# Altium schematic sheet 2_MCU.SchDoc
size A4; SheetNumber: 3; SheetTotal: 6; SPICEModelCacheTOFGAPIR: <root> / <DocumentId>TOFGAPIR</DocumentId> / </root>
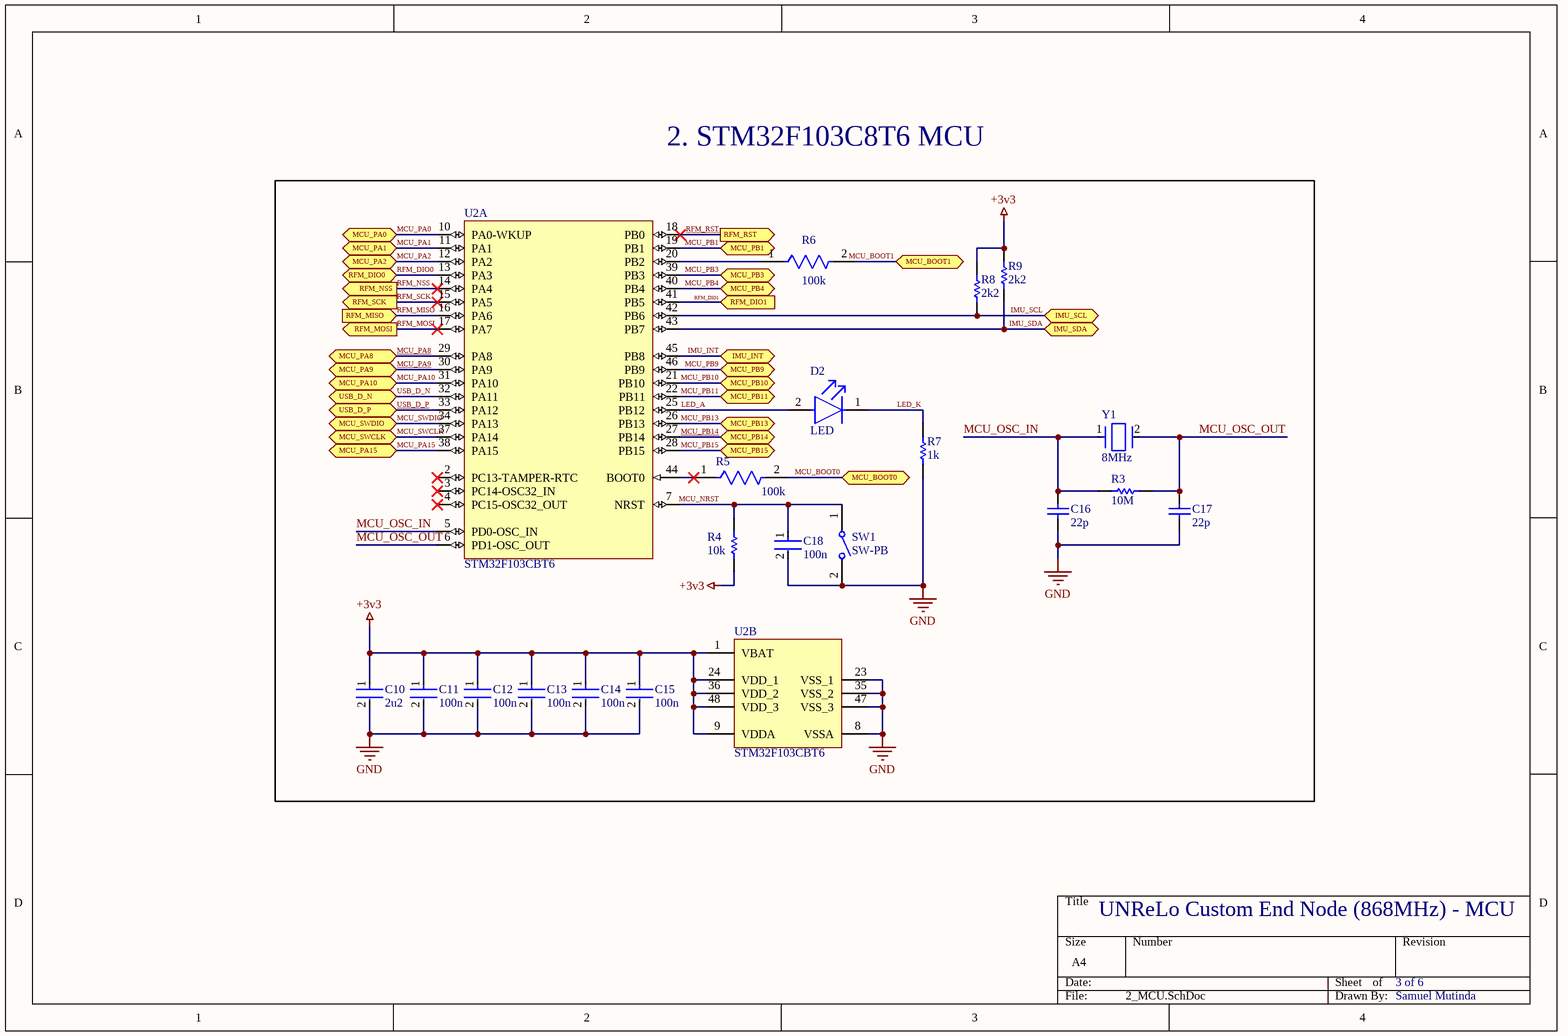
[diagram p0: 2_MCU.SchDoc]

## Parts
C10  2u2  [FP-C0603C225K4PACTU-MFG]
C11  100n  [FP-C0402-BB-MFG]
C12  100n  [FP-C0402-BB-MFG]
C13  100n  [FP-C0402-BB-MFG]
C14  100n  [FP-C0402-BB-MFG]
C15  100n  [FP-C0402-BB-MFG]
C16  22p  [CAPC1006X50X20ML10T10]
C17  22p  [CAPC1006X50X20ML10T10]
C18  100n  [FP-C0402-BB-MFG]
D2  LED  [FP-LTST-C191TBKT-MFG]
R3  10M  [RESC1005X40X25LL05T05]
R4  10k  [RESC1005X40X25LL05T05]
R5  100k  [FP-ERJ2RK-IPC_C]
R6  100k  [FP-ERJ2RK-IPC_C]
R7  1k  [RESC1005X40X25NL05T05]
R8  2k2  [RESC1005X40X25NL05T10]
R9  2k2  [RESC1005X40X25NL05T10]
SW1  SW-PB  [TECO-FSMSM-2_V]
U2  STM32F103CBT6  [STM-LQFP48_L]  (parts A,B of 2)
Y1  8MHz  [FP-ABLS-MFG]

## Ports
IMU_INT (bidir), IMU_SCL (bidir), IMU_SDA (bidir), MCU_BOOT0 (bidir), MCU_BOOT1 (bidir), MCU_PA0 (bidir), MCU_PA1 (bidir), MCU_PA2 (bidir), MCU_PA8 (bidir), MCU_PA9 (bidir), MCU_PA10 (bidir), MCU_PA15 (bidir), MCU_PB1 (bidir), MCU_PB3 (bidir), MCU_PB4 (bidir), MCU_PB9 (bidir), MCU_PB10 (bidir), MCU_PB11 (bidir), MCU_PB13 (bidir), MCU_PB14 (bidir), MCU_PB15 (bidir), MCU_SWCLK (bidir), MCU_SWDIO (bidir), RFM_DIO0 (bidir), RFM_DIO1 (in), RFM_MISO (in), RFM_MOSI (out), RFM_NSS (out), RFM_RST (out), RFM_SCK (out), USB_D_N (bidir), USB_D_P (bidir)

## Nets
+3v3: C10.1 C11.1 C12.1 C13.1 C14.1 C15.1 R4.1 R8.2 R9.2 U2.1(VBAT) U2.9(VDDA) U2.24(VDD_1) U2.36(VDD_2) U2.48(VDD_3)
GND: C10.2 C11.2 C12.2 C13.2 C14.2 C15.2 C16.1 C17.1 C18.2 R7.1 SW1.2 U2.8(VSSA) U2.23(VSS_1) U2.35(VSS_2) U2.47(VSS_3)
IMU_INT: U2.45(PB8) ; port IMU_INT
IMU_SCL: R8.1 U2.42(PB6) ; port IMU_SCL
IMU_SDA: R9.1 U2.43(PB7) ; port IMU_SDA
LED_A: D2.2(A) U2.25(PB12)
LED_K: D2.1(C) R7.2
MCU_BOOT0: R5.2 ; port MCU_BOOT0
MCU_BOOT1: R6.2 ; port MCU_BOOT1
MCU_NRST: C18.1 R4.2 SW1.1 U2.7(NRST)
MCU_OSC_IN: C16.2 R3.1 U2.5(PD0-OSC_IN) Y1.1
MCU_OSC_OUT: C17.2 R3.2 U2.6(PD1-OSC_OUT) Y1.2
MCU_PA0: U2.10(PA0-WKUP) ; port MCU_PA0
MCU_PA1: U2.11(PA1) ; port MCU_PA1
MCU_PA2: U2.12(PA2) ; port MCU_PA2
MCU_PA8: U2.29(PA8) ; port MCU_PA8
MCU_PA9: U2.30(PA9) ; port MCU_PA9
MCU_PA10: U2.31(PA10) ; port MCU_PA10
MCU_PA15: U2.38(PA15) ; port MCU_PA15
MCU_PB1: U2.19(PB1) ; port MCU_PB1
MCU_PB3: U2.39(PB3) ; port MCU_PB3
MCU_PB4: U2.40(PB4) ; port MCU_PB4
MCU_PB9: U2.46(PB9) ; port MCU_PB9
MCU_PB10: U2.21(PB10) ; port MCU_PB10
MCU_PB11: U2.22(PB11) ; port MCU_PB11
MCU_PB13: U2.26(PB13) ; port MCU_PB13
MCU_PB14: U2.27(PB14) ; port MCU_PB14
MCU_PB15: U2.28(PB15) ; port MCU_PB15
MCU_SWCLK: U2.37(PA14) ; port MCU_SWCLK
MCU_SWDIO: U2.34(PA13) ; port MCU_SWDIO
RFM_DIO0: U2.13(PA3) ; port RFM_DIO0
RFM_DIO1: U2.41(PB5) ; port RFM_DIO1
RFM_MISO: U2.16(PA6) ; port RFM_MISO
RFM_MOSI: U2.17(PA7) ; port RFM_MOSI
RFM_NSS: U2.14(PA4) ; port RFM_NSS
RFM_RST: U2.18(PB0) ; port RFM_RST
RFM_SCK: U2.15(PA5) ; port RFM_SCK
USB_D_N: U2.32(PA11) ; port USB_D_N
USB_D_P: U2.33(PA12) ; port USB_D_P
NetR5_1: R5.1 U2.44(BOOT0)
NetR6_1: R6.1 U2.20(PB2)

Not connected (* = marked no-connect by the designer): U2 2(PC13-TAMPER-RTC)* 3(PC14-OSC32_IN)* 4(PC15-OSC32_OUT)*

## Notes on the sheet
- 2. STM32F103C8T6 MCU
- UNReLo Custom End Node (868MHz) - MCU
- 3 of 6
- Samuel Mutinda

## Library data of the parts
C10 = CMP-2006-02259-2: CAP CER 2.2UF 16V X5R 0603; Manufacturer 1: Taiyo Yuden; Dielectric Material: Ceramic; Tolerance: 10%; Dissipation Factor: 5%; Name: EMK107BB7225MA-T; Series: C; Voltage Rating (DC): 16V; REACH SVHC: No SVHC; RoHS Compliant: Yes; Number of Pins: 2; Max Operating Temperature: 85°C; Voltage Rating: 16V; Min Operating Temperature: -55°C; Termination: SMD/SMT; Dielectric: X5R; Packaging: Tape and Reel; Contact Plating: Tin; Case Code (Metric): 1608; Height: 0.8mm; Capacitance: 2.2uF; Case/Package: 0603; Width: 0.8mm; Construction: Flat; Depth: 0.8mm; Thickness: 0.034inch; Radiation Hardening: No; Length: 1.6mm; Mount: Surface Mount; Case Code (Imperial): 0603; Voltage: 16V; Package Quantity: 1; Lead Free: Lead Free; Manufacturer Part Number 1: EMK107BB7225MA-T; Supplier 1: Digi-Key; Supplier Part Number 1: 587-4864-1-ND; Supplier Unit Price 1: $0.27
C11-C15 C18 = CMP-1034-02068-3: CAP CER 0.1UF 16V 10% X7R 0402; Manufacturer 1: TDK Corporation; Value: 0.10 μF; Temperature Coefficient: 15%; Tolerance: 0.1; Material: Ceramic; Name: CGA2B1X7R1C104K050BC; ComponentLink2URL: https://content.kemet.com/datasheets/KEM_C1002_X7R_SMD.pdf; Automotive: No; Device Class L2: Capacitors; Temperature: -55°C to +125°C; RoHS: TRUE; Voltage Rating: 16 V; ComponentLink2Description: Datasheet; Device Class L3: Ceramic Capacitors; Temperature Range Low: -55°C; Ipc Land Pattern Name: CAPC10050X50; Device Class L1: Passive Components; Temperature Range High: +125°C; Package: C0402-BB; Capacitance: 0.10 μF; Category: Cap; Mouser Description: CAP CER 0.1UF 16V X7R 0402; Height: 0.55mm; Digikey Description: CAP CER 0.1UF 16V 5% X7R 0402; Octopart: https://octopart.com/c0402c104j4ractu-kemet-12573893; Temperature Characteristic: X7R; Lead Free: Yes; Manufacturer Part Number 1: CGA2B1X7R1C104K050BC; Supplier 1: Digi-Key; Supplier Part Number 1: 445-5613-1-ND; Supplier Unit Price 1: $0.1
C16 C17 = CMP-2008-04844-1: Manufacturer 1: Murata Electronics; Name: GCM1555G1H220JA16D; Manufacturer Part Number 1: GCM1555G1H220JA16D; Supplier 1: Digi-Key; Supplier Part Number 1: 490-GCM1555G1H220JA16DCT-ND; Supplier Unit Price 1: $0.1
D2 = CMP-22017-000008-1: LED WHITE; Lens Color: Colorless; Dominant Wavelength: 475nm; Forward Current: 20mA; Wavelength: 468nm; Viewing Angle: 130°; Lens Transparency: Clear; Power Dissipation: 76mW; Illumination Color: Blue; Luminous Intensity: 180mcd; Reverse Voltage: 5V; Number of Elements: 1; Lens Style: Diffused; Forward Voltage: 3.8V; Max Power Dissipation: 75mW; Case Code (Metric): 1608; Packaging: Tape and Reel; Case/Package: 0603; Depth: 1.6mm; Mount: Surface Mount; Lead Free: Lead Free; Min Operating Temperature: -20°C; Height: 0.55mm; Test Current: 20mA; Case Code (Imperial): 0603; Max Operating Temperature: 80°C; Number of Pins: 2; Length: 0.8mm; Radiation Hardening: No; Package Quantity: 1; Number of LEDs: 1; Width: 0.8mm; Color: Blue
R3 = CMP-1011-00962-2: Manufacturer 1: Vishay Dale; Name: CRCW040210M0FKED; Manufacturer Part Number 1: CRCW040210M0FKED; Supplier 1: Digi-Key; Supplier Part Number 1: 541-10.0MLCT-ND; Supplier Unit Price 1: $0.1
R4 = CMP-2000-07588-1: Chip Resistor, 10 KOhm, +/- 1%, 0.1 W, -55 to 155 degC, 0402 (1005 Metric), RoHS, Tape and Reel; Manufacturer 1: Vishay Beyschlag/Draloric/BC Components; Power Rating: 100mW; Voltage Rating: 50V; Resistance: 10KOhm; Case\/Package: 0402; Temperature Coefficient: 100ppm\/degreesC; Name: MCS04020C1002FE000; RoHSCompliant: True; Lead Free: LeadFree; Package Quantity: 1; Contact Plating: Tin; Length: 1mm; Radiation Hardening: No; REACH SVHC: NoSVHC; Max Operating Temperature: 155degC; Depth: 0.5mm; Case Code (Imperial): 0402; Military Standard: Not; Package Description: 2-Pin Surface Mount Device, Body 1 x 0.5 mm; Termination: SMD/SMT; Case Code (Metric): 1005; Height: 0.35mm; Packaging: TapeandReel; Voltage Rating (DC): 50V; Package Reference: 402; Number of Pins: 2; Tolerance: 1%; Mounting Technology: SurfaceMount; Width: 0.02inch; Mount: SurfaceMount; Datasheet URL: https://industrial.panasonic.com/cdbs/www-data/pdf/RDA0000/AOA0000C304.pdf; Composition: ThickFilm; Datasheet Version: 02/2017; Max Power Dissipation: 100mW; Number of Terminations: 2; Min Operating Temperature: -55degC; Manufacturer Part Number 1: MCS04020C1002FE000; Supplier 1: Digi-Key; Supplier Part Number 1: MCS0402-10.0K-CFCT-ND; Supplier Unit Price 1: $0.15
R5 R6 = CMP-2002-00608-4: RES SMD 100K OHM 1% 1/10W 0402; Manufacturer 1: Panasonic Electronic Components; Resistance: 100kR; Voltage Rating (DC): 50V; Power Rating: 100mW; Temperature Coefficient: 100ppm/°C; Name: ERJ-PA2J104X; Case/Package: 0402; Length: 1mm; Package Quantity: 1; Radiation Hardening: No; Case Code (Metric): 1005; Contact Plating: Tin; Mount: Surface Mount; Depth: 0.5mm; Max Operating Temperature: 155°C; Lead Free: Lead Free; Width: 0.5mm; Composition: Thick Film; Case Code (Imperial): 0402; Tolerance: 1%; Termination: SMD/SMT; Number of Pins: 2; Height: 0.35mm; Voltage Rating: 50V; Military Standard: Not; REACH SVHC: No SVHC; Packaging: Tape and Reel; Min Operating Temperature: -55°C; Max Power Dissipation: 100mW; Features: Automotive AEC-Q200; Number of Terminations: 2; Manufacturer Part Number 1: ERJ-PA2J104X; Supplier 1: Digi-Key; Supplier Part Number 1: P17205CT-ND; Supplier Unit Price 1: $0.16
R7 = CMP-1011-00510-4: Chip Resistor, 1 KOhm, +/- 1%, 100 mW, -55 to 155 degC, 0402 (1005 Metric), RoHS, Tape and Reel; Manufacturer: Basic Passives; Manufacturer 1: Panasonic Electronic Components; Voltage Rating: 50 V; Case\/Package: 0402; Resistance: 1 KOhm; Power Rating: 100 mW; Name: ERJ-2RKF1001X; DatasheetVersion: 04/2015; Radiation Hardening: No; Pins: 2; Height: 0.35 mm; RoHSCompliant: true; Case Code (Imperial): 0402; ComponentLink2Description: Datasheet; ComponentLink1Description: Manufacturer URL; PackageReference: 0402; Mount: Surface Mount; Package Quantity: 10000; Tolerance: 1%; ComponentLink1URL: http://www.panasonic.com/; PackageDescription: 2-Pin Surface Mount Device, Body 1 x 0.5 mm; Mounting Technology: Surface Mount; Case Code (Metric): 1005; ComponentLink2URL: http://industrial.panasonic.com/cdbs/www-data/pdf/RDA0000/AOA0000C86.pdf; REACH SVHC: Yes; Packaging: Tape and Reel; Max Operating Temperature: 155 degC; Min Operating Temperature: -55 degC; Width: 0.5 mm; Length: 1 mm; Manufacturer Part Number 1: ERJ-2RKF1001X; Supplier 1: Digi-Key; Supplier Part Number 1: P1.00KLCT-ND; Supplier Unit Price 1: $0.10
R8 R9 = CMP-2002-07567-1: Manufacturer 1: YAGEO; Name: RC0402FR-072K2L; Manufacturer Part Number 1: RC0402FR-072K2L; Supplier 1: Digi-Key; Supplier Part Number 1: 311-2.20KLRCT-ND; Supplier Unit Price 1: $0.1
SW1 = CMP-2000-07511-1: FSMSM Push Button Switch, 50 mA, -35 to 85 degC, 2-Pin SMD, RoHS, Bulk; Manufacturer: TE Connectivity; Manufacturer 1: TE Connectivity ALCOSWITCH Switches; Actuator Length: 1.07mm; Electrical Life: 20000Cycles; Actuator Material: Polyamide; Current Rating: 50mA; Illumination Type: Illuminated; Voltage Rating (DC): 24V; Contact Resistance: 100mOhm; Case\/Package: SMD/SMT; Operating Force: 180gf; Switch Travel: 0.25mm; Max Voltage Rating (DC): 12V; Throw Configuration: SPST; Packaging: LoosePiece; Max Operating Temperature: 85degC; ELV: Compliant; Package Description: 2-Pin Surface Mount Device, Body 6 x 3.5 mm, Pitch 9.19 mm; RoHSCompliant: true; Manufacturer URL: http://www.te.com/; Contact Plating: Silver; Contact Material: Brass; Mounting Technology: SurfaceMount; Contact Current Rating: 50mA; Datasheet Version: Rev. C2, 08/2014; Datasheet URL: http://www.te.com/commerce/DocumentDelivery/DDEController?Action=showdoc&DocId=Customer+Drawing%7F1437566-3%7FC2%7Fpdf%7FEnglish%7FENG_CD_1437566-3_C2_1437566_3_1_c.dwg.pdf%7F1437566-3; Mechanical Life: 20000Cycles; Package Reference: FSMSM; REACH SVHC: Unknown; Orientation: Straight; Min Operating Temperature: -35degC; Lead Free: LeadFree; Termination: GullWing; Package Quantity: 1000; Mount: SurfaceMount; Name: FSMSM; Manufacturer Part Number 1: FSMSM; Supplier 1: Digi-Key; Supplier Part Number 1: 450-1140-ND; Supplier Unit Price 1: $0.32
U2 = CMP-0237-00250-3: ARM Cortex-M3 32-bit MCU, 128 KB Flash, 20 KB Internal RAM, 37 I/Os, 48-pin LQFP, -40 to 85 degC, Tray; Manufacturer 1: STMicroelectronics; Supply Voltage(Vcc) min (V): 2; Operating Frequency(F) (Processor speed) (MHz): 72; A/D Converter: 2x12-bit (10 Channel); FLASH Size (Prog) (kB): 128; Internal RAM Size (kB): 20; I/Os (High Current): 37; ComponentLink2Description: Datasheet; PackageReference: LQFP48; ComponentLink1Description: Manufacturer URL; DatasheetVersion: Rev. 16; PackageVersion: Rev. 6, 06/2013; Packing: Tray; ComponentLink1URL: http://www.st.com/web/en/home.html; Mounting Technology: Surface Mount; ComponentLink3URL: http://www.st.com/st-web-ui/static/active/en/resource/technical/document/datasheet/DM00058181.pdf; PackageDescription: 48-Pin Low Profile Quad Flat Package, 7 x 7 mm Body, 0.5 mm Pitch; Core: ARM Cortex-M3; ComponentLink3Description: Package Specification; ComponentLink2URL: http://www.st.com/st-web-ui/static/active/en/resource/technical/document/datasheet/CD00161566.pdf; Name: STM32F103CBT6; Manufacturer Part Number 1: STM32F103CBT6; Supplier 1: Digi-Key; Supplier Part Number 1: 497-6288-ND; Supplier Unit Price 1: $7.66
Y1 = CMP-27762-009874-1: CRYSTAL 8.0000MHZ 18PF SMD; Manufacturer 1: Abracon LLC; ESR (Equivalent Series Resistance): 80R; Frequency Stability: 50ppm; Tolerance: 20ppm; Name: ABLS-8.000MHZ-K4T; Min Operating Temperature: -20°C; Lead Free: Lead Free; Operating Frequency: 8 MHz; Width: 4.7mm; Packaging: Tape and Reel; Series: ABLS; Accuracy: 20ppm; Length: 11.4mm; Frequency Tolerance: 20ppm; Termination: SMD/SMT; Number of Pins: 2; Radiation Hardening: No; Depth: 4.7mm; REACH SVHC: No SVHC; Contact Plating: Tin; Load Capacitance: 18pF; Case/Package: SMD/SMT; Mount: Surface Mount; Package Quantity: 1000; Max Operating Temperature: 70°C; Height: 0.165inch; Frequency: 8MHz; Series Resistance: 80R; Manufacturer Part Number 1: ABLS-8.000MHZ-K4T; Supplier 1: Digi-Key; Supplier Part Number 1: 535-9937-1-ND; Supplier Unit Price 1: $0.4